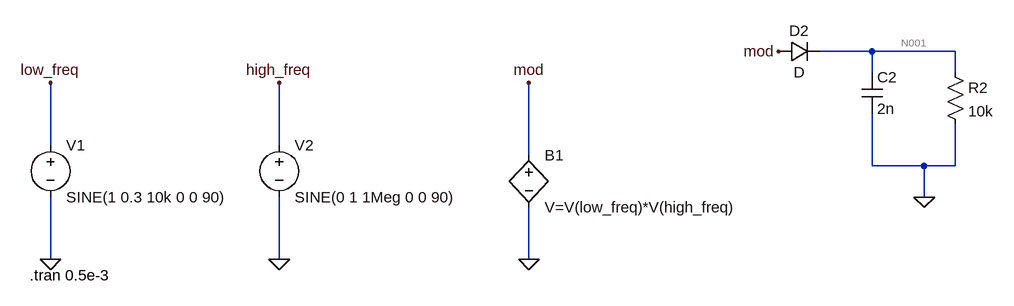
[diagram p0: schematic Mod_Generator.asc]
Mod_Generator.asc, the LTspice schematic file:
Version 4.1
SHEET 1 1668 680
WIRE 1168 -16 1088 -16
WIRE 1296 -16 1168 -16
WIRE 1168 16 1168 -16
WIRE 1296 16 1296 -16
WIRE -96 128 -96 32
WIRE 256 128 256 32
WIRE 640 144 640 32
WIRE 1168 160 1168 80
WIRE 1248 160 1168 160
WIRE 1296 160 1296 96
WIRE 1296 160 1248 160
WIRE 1248 208 1248 160
WIRE -96 304 -96 208
WIRE 256 304 256 208
WIRE 640 304 640 224
FLAG -96 304 0
FLAG 256 304 0
FLAG -96 32 low_freq
FLAG 256 32 high_freq
FLAG 640 304 0
FLAG 640 32 mod
FLAG 1024 -16 mod
FLAG 1248 208 0
SYMBOL voltage -96 112 R0
WINDOW 123 0 0 Left 0
WINDOW 39 0 0 Left 0
SYMATTR InstName V1
SYMATTR Value SINE(1 0.3 10k 0 0 90)
SYMBOL voltage 256 112 R0
WINDOW 123 0 0 Left 0
WINDOW 39 0 0 Left 0
SYMATTR InstName V2
SYMATTR Value SINE(0 1 1Meg 0 0 90)
SYMBOL bv 640 128 R0
SYMATTR InstName B1
SYMATTR Value V=V(low_freq)*V(high_freq)
SYMBOL diode 1024 0 R270
WINDOW 0 32 32 VTop 2
WINDOW 3 0 32 VBottom 2
SYMATTR InstName D2
SYMBOL cap 1152 16 R0
SYMATTR InstName C2
SYMATTR Value 2n
SYMBOL res 1280 0 R0
SYMATTR InstName R2
SYMATTR Value 10k
TEXT -128 328 Left 2 !.tran 0.5e-3

The netlist it stands for:
* Mod_Generator.asc
V1 low_freq 0 SINE(1 0.3 10k 0 0 90)
V2 high_freq 0 SINE(0 1 1Meg 0 0 90)
B1 mod 0 V=V(low_freq)*V(high_freq)
D2 mod N001 D
C2 N001 0 2n
R2 N001 0 10k
.model D D
.lib standard.dio
.tran 0.5e-3
.backanno
.end

* Results of the author's LTspice run, read from the files saved beside the schematic
* Operating Point, zero values left out:
*   V(high_freq) = 1 V
*   V(n001) = 713.2 mV
*   V(low_freq) = 1.3 V
*   V(mod) = 1.3 V
*   I(B1) = -71.32 µA
*   I(R2) = 71.32 µA
*   I(D2) = 71.32 µA
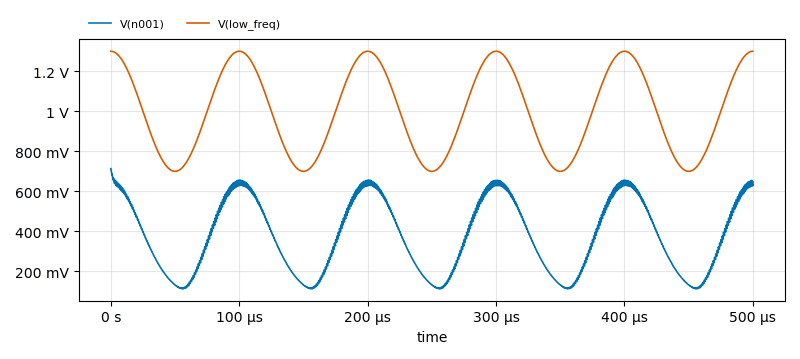
[diagram p1: Transient Analysis of Mod_Generator.asc, plotted from the saved traces]
* Transient Analysis, 1 run:
*   V(n001): min 112.9 mV, max 713.2 mV, average 377.8 mV, rms 420.5 mV, last 647.6 mV
*   V(low_freq): min 700 mV, max 1.3 V, average 1 V, rms 1.022 V, last 1.3 V